# Altium schematic sheet Sensor.SchDoc
size A4; SheetNumber: 4; SheetTotal: 6
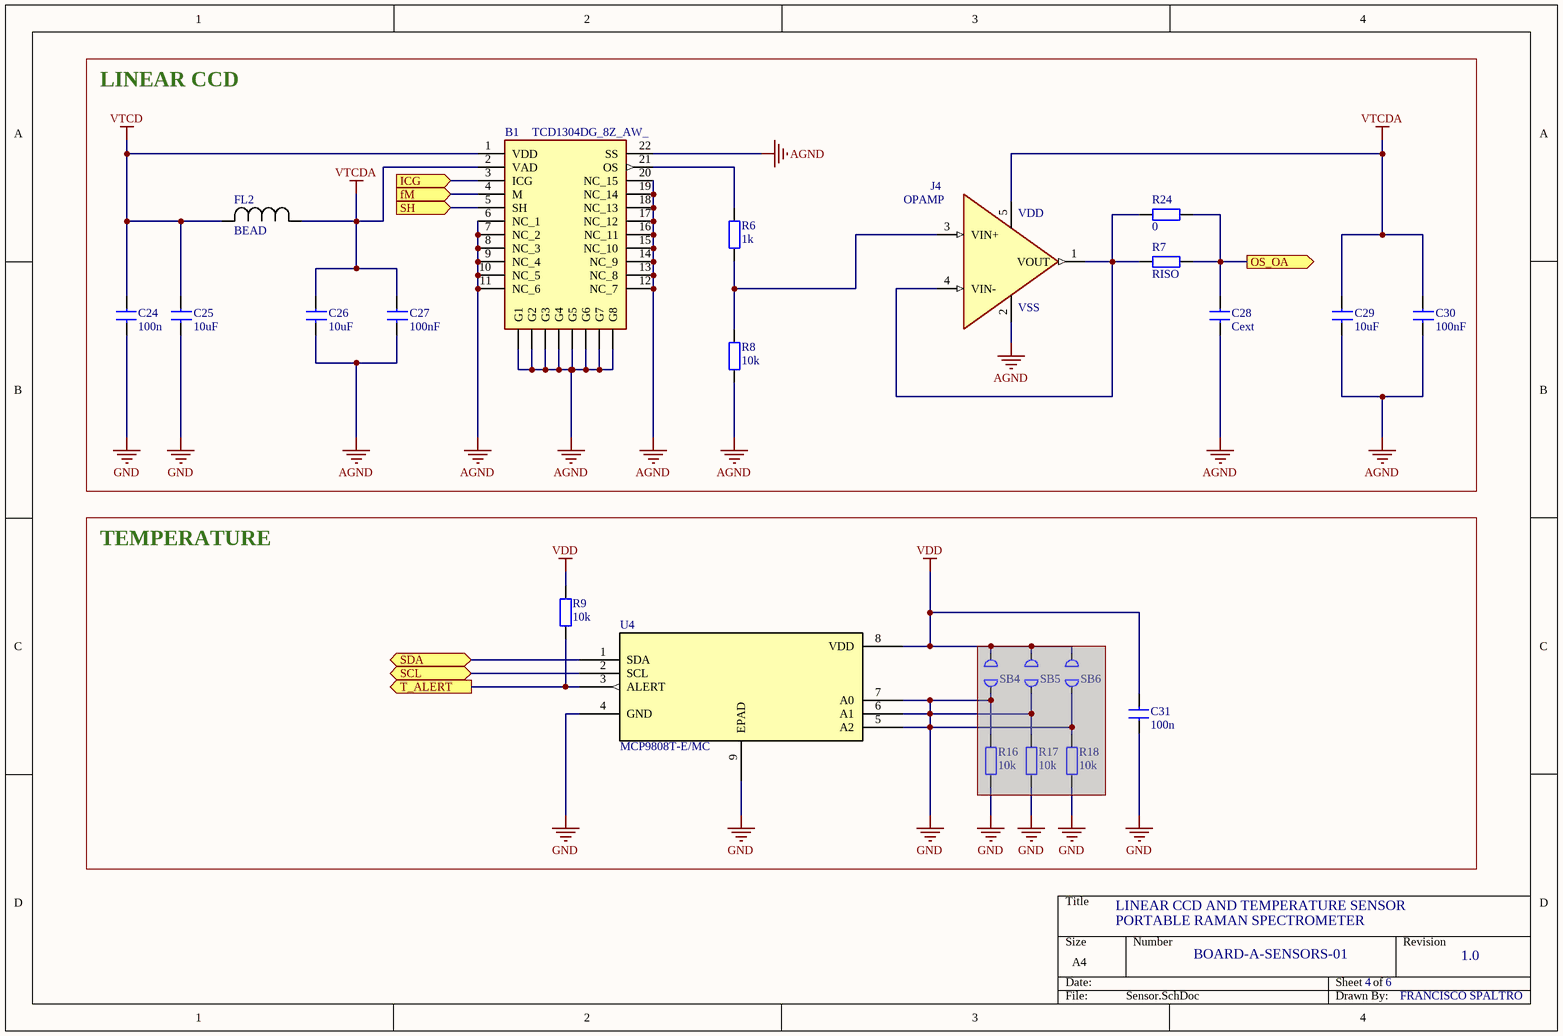
[diagram p0: Sensor.SchDoc]

## Parts
B1  TCD1304DG_8Z_AW_  [SOCKET-15_SMD-HARWIN_M20-7861546]
C24  100n  [RES_0805]
C25  10uF  [RES_0805]
C26  10uF  [RES_0805]
C27  100nF  [RES_0805]
C28  Cext  [RES_0805]
C29  10uF  [RES_0805]
C30  100nF  [RES_0805]
C31  100n  [RES_0805]
FL2  BEAD  [IND_1608_TDK-M]
J4  OPAMP  [SOT95P280X145-5N]
R6  1k  [RES_0805]
R7  RISO  [RES_0805]
R8  10k  [RES_0805]
R9  10k  [RES_0805]
R16  10k  [RES_0805]  (masked out: inside a compile mask, not in the netlist)
R17  10k  [RES_0805]  (masked out: inside a compile mask, not in the netlist)
R18  10k  [RES_0805]  (masked out: inside a compile mask, not in the netlist)
R24  0  [RES_0805]
SB4  SolderBridge_Open  [SolderBridge_Open]  (value not drawn)  (masked out: inside a compile mask, not in the netlist)
SB5  SolderBridge_Open  [SolderBridge_Open]  (value not drawn)  (masked out: inside a compile mask, not in the netlist)
SB6  SolderBridge_Open  [SolderBridge_Open]  (value not drawn)  (masked out: inside a compile mask, not in the netlist)
U4  MCP9808T-E/MC  [DFN8_2x3MC_MCH-M]

## Blocks framed on the sheet
LINEAR CCD: B1 C24-C30 FL2 J4 R6-R8 R24
TEMPERATURE: C31 R9 R16-R18 SB4-SB6 U4

## Ports
fM (in, see Main[2D], Microcontroller[2B], Out[3C]), ICG (in, see Main[2D], Microcontroller[2B], Out[3C]), OS_OA (out, see Main[2D], Microcontroller[1B], Out[3C]), SCL (bidir, see Main[2C], Microcontroller[2B], Out[2A]), SDA (bidir, see Main[2C], Microcontroller[3C], Out[2B]), SH (in, see Main[2D], Microcontroller[2B], Out[3C]), T_ALERT (out, see Main[2C], Microcontroller[3B])

## Nets
AGND: B1.6(NC_1) B1.7(NC_2) B1.8(NC_3) B1.9(NC_4) B1.10(NC_5) B1.11(NC_6) B1.12(NC_7) B1.13(NC_8) B1.14(NC_9) B1.15(NC_10) B1.16(NC_11) B1.17(NC_12) B1.18(NC_13) B1.19(NC_14) B1.20(NC_15) B1.22(SS) B1.G1 B1.G2 B1.G3 B1.G4 B1.G5 B1.G6 B1.G7 B1.G8 C26.2 C27.2 C28.1 C29.2 C30.2 J4.2(VSS) R8.2
GND: C24.1 C25.2 C31.1 U4.4(GND) U4.5(A2) U4.6(A1) U4.7(A0) U4.9(EPAD)
VDD: C31.2 R9.2 U4.8(VDD)
VTCD: B1.1(VDD) C24.2 C25.1 FL2.2
VTCDA: B1.2(VAD) C26.1 C27.1 C29.1 C30.1 FL2.1 J4.5(VDD)
fM: B1.4(M) ; port fM
ICG: B1.3(ICG) ; port ICG
OS_OA: C28.2 R7.2 R24.2 ; port OS_OA
SCL: U4.2(SCL) ; port SCL
SDA: U4.1(SDA) ; port SDA
SH: B1.5(SH) ; port SH
T_ALERT: R9.1 U4.3(ALERT) ; port T_ALERT
NetB1_21: B1.21(OS) R6.1
NetJ4_1: J4.1(VOUT) J4.4(VIN-) R7.1 R24.1
NetJ4_3: J4.3(VIN+) R6.2 R8.1

## Notes on the sheet
- LINEAR CCD AND TEMPERATURE SENSOR
- PORTABLE RAMAN SPECTROMETER
- BOARD-A-SENSORS-01
- 4
- 6
- 1.0
- FRANCISCO SPALTRO

## Library data of the parts
B1 = TCD1304DG_8Z_AW_: Image Sensors & Color Sensors CCD Linear Sensor 3648 8x20 54mm; Manufacturer_Name: Toshiba; Manufacturer_Part_Number: TCD1304DG(8Z,AW); Geometry.Height: 3.72mm; Mouser Part Number: 757-TCD1304DG8ZAW; Mouser Price/Stock: https://www.mouser.co.uk/ProductDetail/Toshiba/TCD1304DG8ZAW?qs=OLJpxlzHOSRVMcyirxbASw%3D%3D; Datasheet Link: https://datasheet.datasheetarchive.com/originals/distributors/DKDS-29/569259.pdf
C24-C31 = CAP_0805: Generic Capacitor
FL2 = MMZ1608B601CTAH0: INDUCTOR; SMT (0603); FERRITE-BEAD; 600; TOL=+/-25%; 0.5A; -55 DEGC TO +125 DEGC; Manufacturer_Name: TDK; Copyright: Copyright (C) 2025 Ultra Librarian. All rights reserved.; Manufacturer_Part_Number: MMZ1608B601CTAH0
J4 = OPAMP-MCP6001UT-E/OT: Microchip MCP6001UT-E/OT Op Amp, 1MHz Rail-Rail, 1.8 - 6 V, 5-Pin SOT-23 | Microchip Technology Inc. MCP6001UT-E/OT; SnapEDA_Link: https://www.snapeda.com/parts/MCP6001UT-E/OT/Microchip/view-part/?ref=snap; Package: SOT-23 Microchip; Value: *; MF: Microchip; MP: MCP6001UT-E/OT; Check_prices: https://www.snapeda.com/parts/MCP6001UT-E/OT/Microchip/view-part/?ref=eda
R6-R9 R16-R18 R24 = RES_0805: Generic Capacitor
U4 = MCP9808T-EMC: Description; Manufacturer_Name: Microchip; Copyright: Copyright (C) 2026 Ultra Librarian. All rights reserved.; Manufacturer_Part_Number: MCP9808T-E/MC; RefDes: RefDes; Type: Type